# EAGLE design Adafruit Feather 32u4 Basic rev B (EAGLE 6.6.0)
COMPANY: ADAFRUIT INDUSTRIES; DRAWN: KTOWN; REV: B
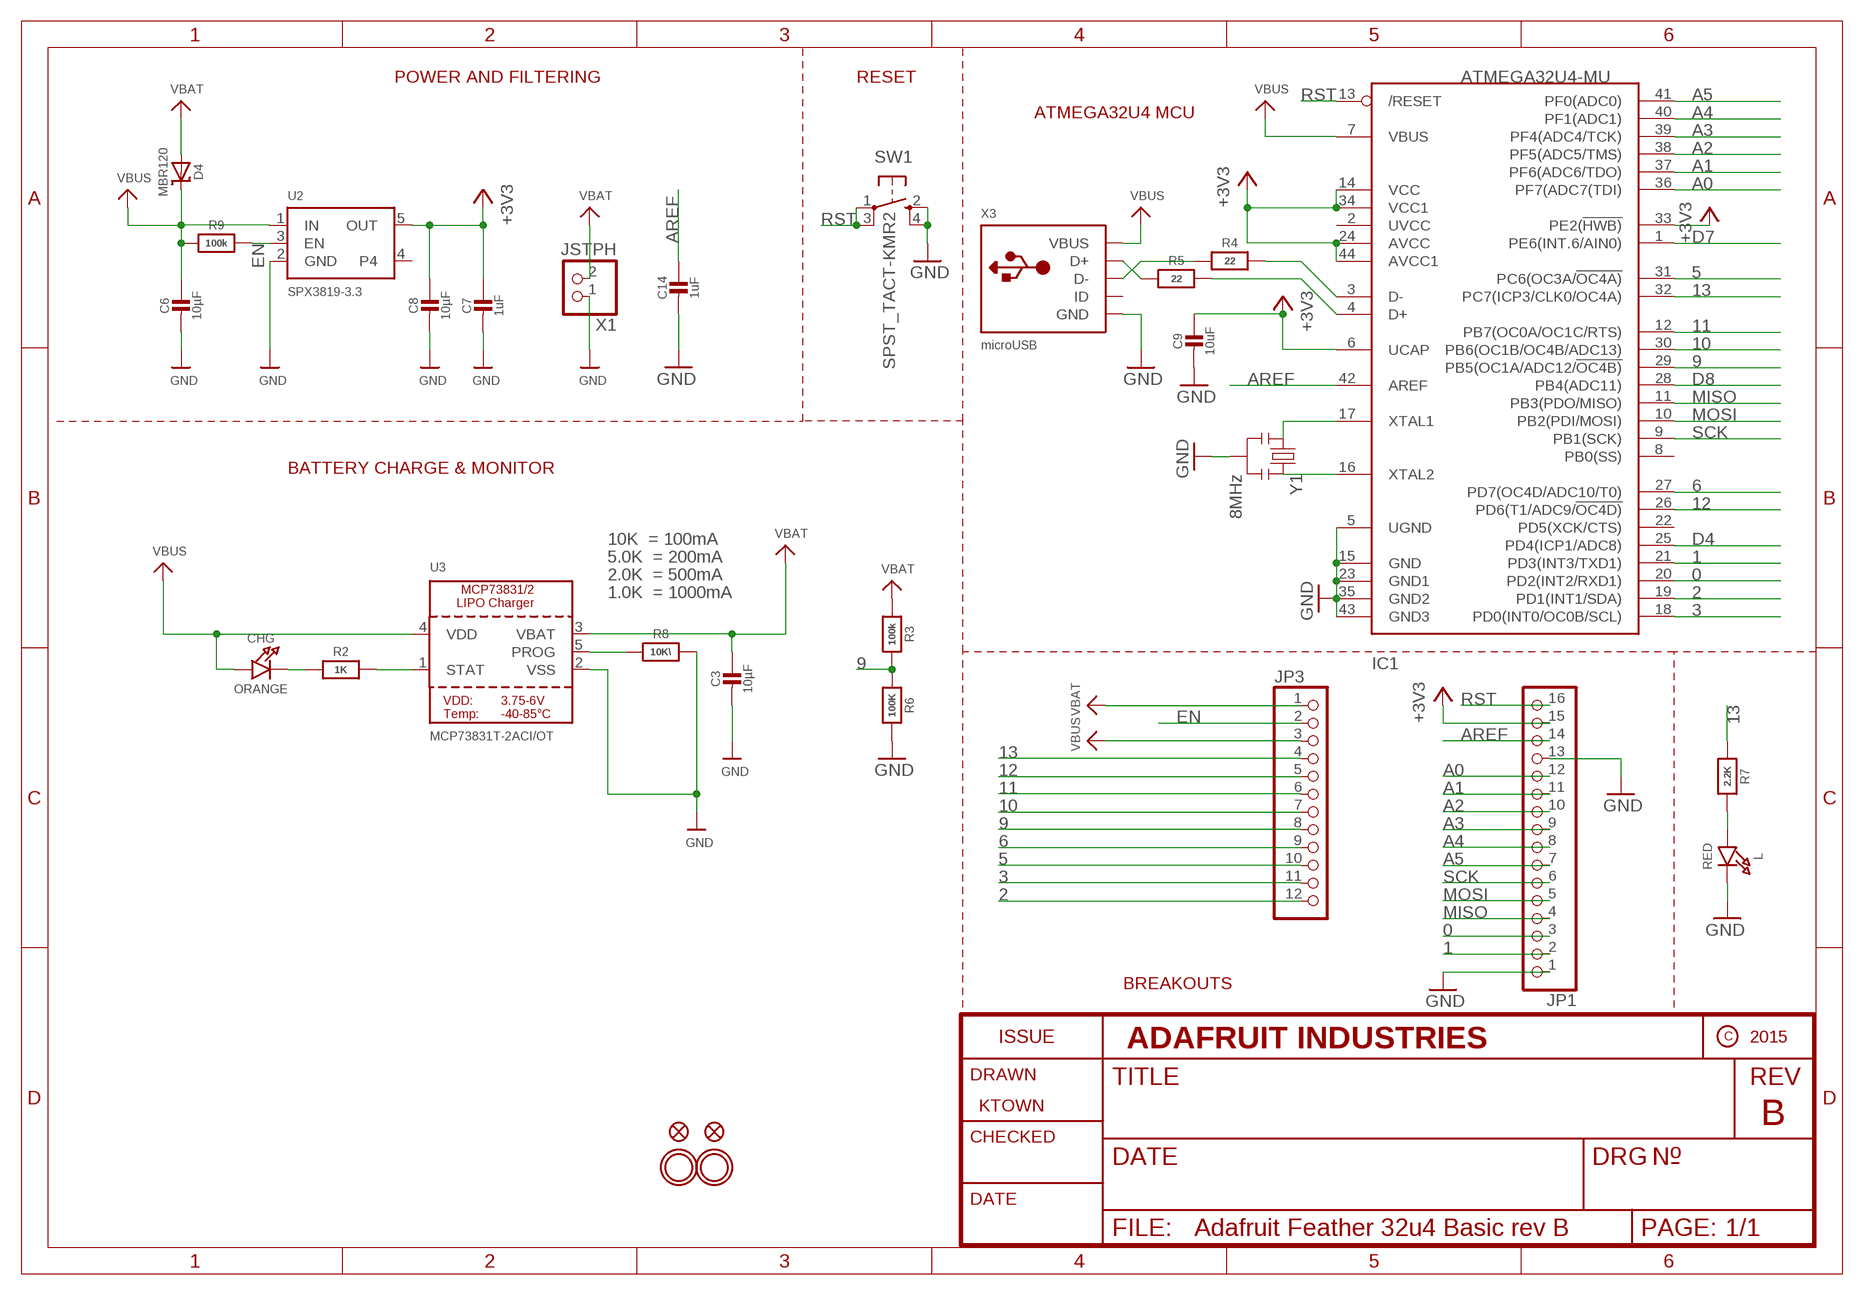
[diagram p0: schematic, sheet 1]

## Parts
C3  10µF  CAP_CERAMIC0805-NOOUTLINE  [0805-NO]
C6  10µF  CAP_CERAMIC0805-NOOUTLINE  [0805-NO]
C7  1uF  CAP_CERAMIC0603_NO  [0603-NO]
C8  10µF  CAP_CERAMIC0805-NOOUTLINE  [0805-NO]
C9  10uF  CAP_CERAMIC0805-NOOUTLINE  [0805-NO]
C14  1uF  CAP_CERAMIC0603_NO  [0603-NO]
CHG  ORANGE  LED0805_NOOUTLINE  [CHIPLED_0805_NOOUTLINE]
D4  MBR120  DIODE-SCHOTTKYSOD-123  [SOD-123]
IC1  ATMEGA32U4-MU  [TQFN44_7MM]
JP1  HEADER-1X16ROUND  [1X16_ROUND]
JP3  HEADER-1X12  [1X12_ROUND]
L  RED  LED0805_NOOUTLINE  [CHIPLED_0805_NOOUTLINE]
R2  1K  RESISTOR_0603_NOOUT  [0603-NO]
R3  100k  RESISTOR_0603_NOOUT  [0603-NO]
R4  22  RESISTOR_0603_NOOUT  [0603-NO]
R5  22  RESISTOR_0603_NOOUT  [0603-NO]
R6  100K  RESISTOR_0603MP  [_0603MP]
R7  2.2K  RESISTOR_0603_NOOUT  [0603-NO]
R8  10K\  RESISTOR_0603_NOOUT  [0603-NO]
R9  100k  RESISTOR_0603_NOOUT  [0603-NO]
SW1  SPST_TACT-KMR2  [KMR2]
U2  SPX3819-3.3  VREG_SOT23-5  [SOT23-5]
U3  MCP73831T-2ACI/OT  MCP73831/2  [SOT23-5]
U$31  MOUNTINGHOLE2.5  [MOUNTINGHOLE_2.5_PLATED]
U$32  MOUNTINGHOLE2.5  [MOUNTINGHOLE_2.5_PLATED]
U$34  FIDUCIAL""  [FIDUCIAL_1MM]
U$35  FIDUCIAL""  [FIDUCIAL_1MM]
X1  JSTPH  CON_JST_PH_2PIN  [JSTPH2]
X3  microUSB  USB_MICRO_20329_V2  [4UCONN_20329_V2]
Y1  8MHz  RESONATORSMD  [RESONATOR-SMD]

## Nets
0: IC1.20(PD2(INT2/RXD1)) JP1.3
1: IC1.21(PD3(INT3/TXD1)) JP1.2
2: IC1.19(PD1(INT1/SDA)) JP3.12
3: IC1.18(PD0(INT0/OC0B/SCL)) JP3.11
5: IC1.31(PC6(OC3A/!OC4A)) JP3.10
6: IC1.27(PD7(OC4D/ADC10/T0)) JP3.9
9: IC1.29(PB5(OC1A/ADC12/!OC4B)) JP3.8 R3.2 R6.1
10: IC1.30(PB6(OC1B/OC4B/ADC13)) JP3.7
11: IC1.12(PB7(OC0A/OC1C/RTS)) JP3.6
12: IC1.26(PD6(T1/ADC9/!OC4D)) JP3.5
13: IC1.32(PC7(ICP3/CLK0/OC4A)) JP3.4 R7.1
+3V3: C7.1 C8.1 C9.1 IC1.6(UCAP) IC1.14(VCC) IC1.24(AVCC) IC1.33(PE2(!HWB)) IC1.34(VCC1) IC1.44(AVCC1) JP1.15 U2.5(OUT)
A0: IC1.36(PF7(ADC7(TDI)) JP1.12
A1: IC1.37(PF6(ADC6/TDO)) JP1.11
A2: IC1.38(PF5(ADC5/TMS)) JP1.10
A3: IC1.39(PF4(ADC4/TCK)) JP1.9
A4: IC1.40(PF1(ADC1)) JP1.8
A5: IC1.41(PF0(ADC0)) JP1.7
AREF: C14.1 IC1.42(AREF) JP1.14
D4: IC1.25(PD4(ICP1/ADC8))
D7: IC1.1(PE6(INT.6/AIN0))
D8: IC1.28(PB4(ADC11))
D+: IC1.4(D+) R5.2
D-: IC1.3(D-) R4.2
EN: JP3.2 R9.2 U2.3(EN)
GND: C3.2 C6.2 C7.2 C8.2 C9.2 C14.2 IC1.5(UGND) IC1.15(GND) IC1.23(GND1) IC1.35(GND2) IC1.43(GND3) JP1.1 JP1.13 L.C R6.2 R8.2 SW1.2(S) SW1.4(S1) U2.2(GND) U3.2(VSS) X1.1 X3.BASE@1(GND) X3.BASE@2(GND) X3.GND X3.SPRT@1(GND) X3.SPRT@2(GND) X3.SPRT@3(GND) X3.SPRT@4(GND) Y1.2
MISO: IC1.11(PB3(PDO/MISO)) JP1.4
MOSI: IC1.10(PB2(PDI/MOSI)) JP1.5
N$1: CHG.C R2.1
N$2: L.A R7.2
N$3: R2.2 U3.1(STAT)
N$4: R8.1 U3.5(PROG)
N$11: IC1.16(XTAL2) Y1.3
N$12: IC1.17(XTAL1) Y1.1
N$15: R5.1 X3.D+
N$16: R4.1 X3.D-
RST: IC1.13(/RESET) JP1.16 SW1.1(P) SW1.3(P1)
SCK: IC1.9(PB1(SCK)) JP1.6
VBAT: C3.1 D4.A JP3.1 R3.1 U3.3(VBAT) X1.2
VBUS: C6.1 CHG.A D4.C IC1.7(VBUS) JP3.3 R9.1 U2.1(IN) U3.4(VDD) X3.VBUS
Unconnected: IC1.2(UVCC) IC1.8(PB0(SS)) IC1.22(PD5(XCK/CTS)) U2.4 X3.ID

## Notes on the sheet
- POWER AND FILTERING | RESET
- ATMEGA32U4 MCU
- BATTERY CHARGE & MONITOR
- 10K  = 100mA
- 5.0K  = 200mA
- 2.0K  = 500mA
- 1.0K  = 1000mA
- BREAKOUTS

## Library data of the parts
C3 C6-C9 C14 = microbuilder:CAP_CERAMIC: Ceramic Capacitors For new designs, use the packages preceded by an '_' character since they are more reliable: The following footprints should be used on most boards: _0402 - Standard footprint for regular board layouts _0603 - Standard footprint for regular board layouts _0805 - Standard footprint for regular board layouts _1206 - Standard footprint for regular board layouts For extremely tight-pitch boards where space is at a premium, the following 'micro-pitch' footprints can be used (smaller pads, no silkscreen outline, etc.): _0402MP - Micro-pitch footprint for very dense/compact boards _0603MP - Micro-pitch footprint for very dense/compact boards _0805MP - Micro-pitch footprint for very dense/compact boards _1206MP - Micro-pitch footprint for very dense/compact boards
CHG L = microbuilder:LED: LED 0603 - 0603 Surface Mount Package 2mA: Green LED - Low Power (3.9mcd, 2ma, 1.7Vf) - Digikey: 475-2709-2-ND Orange LED - Low Power (9.8mcd, 2ma, 1.8Vf) - Digikey: 475-1194-2-ND Red LED - Low Power (5mcd, 2ma, 1.8Vf) - Digikey: 475-1195-2-ND Yellow LED - Low Power (7mcd, 2ma, 1.8Vf) - Digikey: 475-1196-2-ND 5mA: Blue LED - Low Power (17mcd, 5ma, 2.9Vf) - Digikey: LNJ937W8CRACT-ND 0805 - 0805 Surface Mount Package 2mA: Red LED (8.8mcd, 2mA, 1.8Vf, Clear) - Low Power [Digikey: 475-2510-1-ND] Green LED (5mcd, 2mA, 1.8Vf, Clear) - Low Power [Digikey: 475-2730-1-ND] Yellow LED (11.3mcd, 2mA, 1.8Vf, Clear) - Low Power [Digikey: 475-2555-1-ND] 20mA: Red LED (104mcd, 20mA, Diffused) - LS R976 [Digikey: 475-1278-6-ND] Red LED (12mcd, 20mA, 2.0Vf, Clear) - APT2012EC [Digikey: 754-1128-1-ND] Green LED (15mcd, 20mA, 2.2Vf, Clear) - APT2012GC [Digikey: 754-1131-1-ND] Orange LED (160mcd, 20mA, 2.1Vf, Clear) - APT2012SECK [Digikey: 754-1130-1-ND] 1206 - 1206 Surface Mount Package Green LED (26mcd, 20mA, Diffused) - LG N971 [Digikey: 475-1407-6-ND] Red LED (15mcd, 20mA, Diffused) - LH N974 [Digikey: 475-1416-6-ND] Cree - Cree High-Power Surface Mount LEDs XPEBWT-L1-0000-00D50 - White 111lm 350mA 2.9Vf 6200K 110° XTEAWT-00-0000-00000LEE3 - White 114lm 350mA 2.85Vf 5000K 115° Everlight - Everlight 45-21 Series Surface Mount LEDs 45-21/QK2C-B2832AC2CB2/2T - Warm White 2000mcd 20mA 3.25Vf 3050K 120° 45-21/LK2C-B38452C4CB2/2T - Nuetral White 2000mcd 20mA 3.25Vf 4150K 120° 45-21/LK2C-B50634C6CB2/2T - Cold White 2200mcd 20mA 3.25Vf 5650K 120° PLCC2 Reverse Mount LS T77K-J1L2-1-0-2-R18-Z - Red 11.25mcd 2mA 1.8Vf 630nm 120° LO T77K-L1M2-24-Z - Orange 19.6mcd 2mA 1.8Vf 606nm 120° LY T77K-K2M1-26-Z - Yellow 15.7mcd 2mA 1.8Vf 587nm 120°
D4 = microbuilder:DIODE-SCHOTTKY
IC1 = microbuilder:ATMEGA32U4: http://www.ladyada.net/library/eagle
JP1 = microbuilder:HEADER-1X16: PIN HEADER
JP3 = microbuilder:HEADER-1X12
R2-R9 = microbuilder:RESISTOR: Resistors For new designs, use the packages preceded by an '_' character since they are more reliable: The following footprints should be used on most boards: _0402 - Standard footprint for regular board layouts _0603 - Standard footprint for regular board layouts _0805 - Standard footprint for regular board layouts _1206 - Standard footprint for regular board layouts For extremely tight-pitch boards where space is at a premium, the following 'micro-pitch' footprints can be used (smaller pads, no silkscreen outline, etc.): _0402MP - Micro-pitch footprint for very dense/compact boards _0603MP - Micro-pitch footprint for very dense/compact boards _0805MP - Micro-pitch footprint for very dense/compact boards _1206MP - Micro-pitch footprint for very dense/compact boards
SW1 = adafruit:SPST_TACT: SMT 6mm switch, EVQQ2 series http://www.ladyada.net/library/eagle
U2 = microbuilder:VREG_SOT23-5: SOT23-5 Fixed Voltage Regulators Part Current Out V Out V In V Dropout θJA (°C/W) TJ (°C) Digikey Part No. ADP121 150mA 3.3V 3.4-5.5V 0.09V @ 150mA -- -- ADP121-AUJZ33R7CT-ND ADP121 150mA 3.0V 3.1-5.5V 0.09V @ 150mA -- -- ADP121-AUJZ30R7CT-ND ADP122 300mA 3.3V 3.4-5.5V 0.085V @ 300mA -- -- ADP122AUJZ-3.3-R7CT-ND ADP1712 300mA 3.3V 3.5-5.5V 0.17V @ 300mA -- -- ADP1712AUJZ-3.3-R7TR-ND AP7311 (Low Cost) 150mA 3.3V 3.5-6V 0.15V @ 150mA -- -- AP7311-33WG-7DICT-ND LD39015M18R 150mA 1.8V 1.9V-5.5V 0.08V @ 100mA -- -- 497-6977-1-ND LP2985A-33DBVR 150mA 3.3V 3.3-16V 0.28V @ 150mA 206 150 296-18479-1-ND MCP1824T-3302E/OT 300mA 3.3V 3.5V-6V 0.2V @ 300mA -- -- MCP1824T-3302E/OTCT-ND MIC5205-2.5YM5 TR 150mA 2.5V 2.7-16V 0.165V @ 150mA -- -- 576-1257-2-ND MIC5205-3.0YM5 TR 150mA 3.0V 3.2V-16V 0.165V @ 150mA -- -- 576-1258-2-ND MIC5205-3.3YM5 TR 150mA 3.3V 3.5V-16V 0.165V @ 150mA -- -- 576-1259-2-ND TPS780330220 150mA 3.3V+2.2V 3.6-5.5V 250mV Max -- -- 296-23332-1-ND TDA3663/N1,135 100mA 3.3V 3.5-45V 0.18V @ 50mA -- -- 568-5343-1-ND Max operating temp can be calculated using θJA, TJ (max junction temperature), and power in watts. Set the "Maximum Ambient Temperature" until it reaches TJ ("Max Junction Temperature"), which is the absolute limit for safe use of the regulator: Heat Sink Temperature Calculator <http://www.daycounter.com/Calculators/Heat-Sink-Temperature-Calculator.phtml> For example, With 12V source into a 3.3V LP2985 and a 30mA load, we are dissipating (12V-3.3V) * 0.03A = 0.261W. With a θJA of 206 °C/W, a TJ of 150°C, and 261mW we can safely use the chip without a heat sink up to 75°C (=147.1°C Junction Temperature).
U3 = microbuilder:MCP73831/2: MCP73831/2 LIPO Charger VDD: 3.75 - 6V Temp -40 - 85°C Programmable Charge Rate: 15-500mA NOTE: STAT is a tri-state logic output on the MCP73831 and an open-drain output on the MCP73832. SOT23-5 with 4.2V output and tri-state logic on STAT = MCP73831T-2ACI/OT
U$31 U$32 = microbuilder:MOUNTINGHOLE: Mounting Hole For #2 screws (0.086"/2.18mm width, 0.094"/2.4mm hole) use 2.5mm; BOM: EXCLUDE
U$34 U$35 = microbuilder:FIDUCIAL: Fiducial Alignment Points Various fiducial points for machine vision alignment.; BOM: EXCLUDE
X1 = microbuilder:CON_JST_PH_2PIN: JST 2-Pin Right-Angle Connector PH-Series - 4UConnector: 17311 SH-Series - 4UConnector: 07278
X3 = microbuilder:USB: USB Connectors USBMINIB - Surface Mount Female Mini-B USB Connector 4UConnector: 06564
Y1 = SparkFun:RESONATOR: Resonator Small SMD resonator. This is the itty bitty 10/20MHz resonators with built in caps. CSTCE10M0G55 and CSTCE20M0V53. Footprint has been reviewed closely but hasn't been tested yet.

## Board
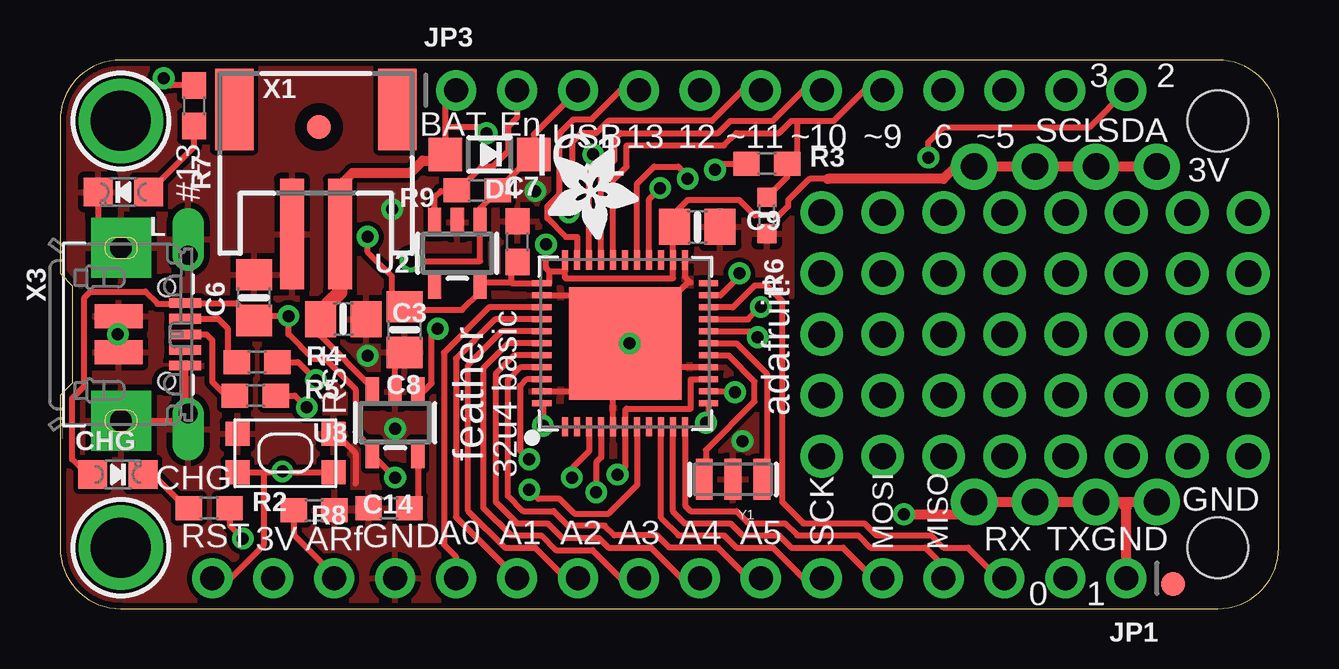
[diagram p1: board, top side]
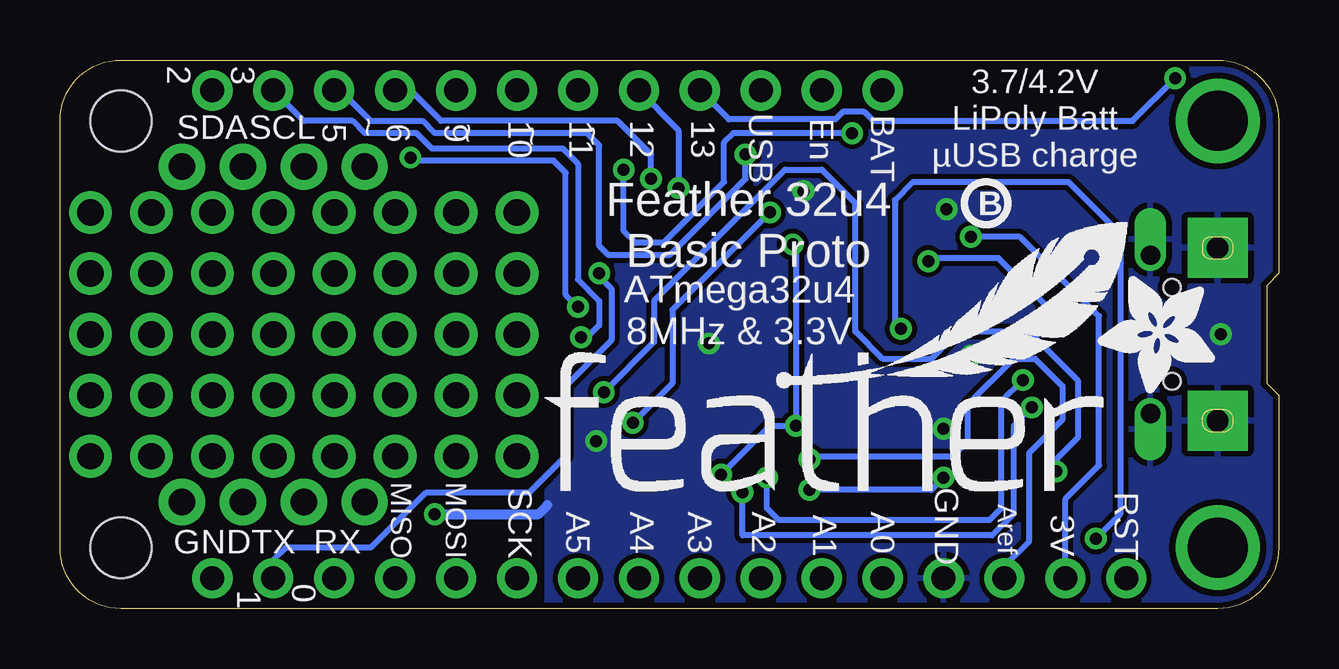
[diagram p2: board, bottom side, seen from below]

Size 50.8 x 22.86 mm. Coordinates in mm from the lower left corner, seen from the top.
Outline: 2.54,0 48.26,0 arc90 50.8,2.54 50.8,20.32 arc90 48.26,22.86 2.54,22.86 arc90 0,20.32 0,13.97 0.51,13.46 0.51,9.4 0,8.89 0,2.54 arc90 2.54,0
Copper layers (1*16): Top 0.035mm / dielectric 1.5mm / Bottom 0.035mm
Design rules "adafruit *": minimum track width 8mil, minimum drill 15.5mil, track to track 8mil, track to pad 8mil, pad to pad 8mil, via to via 8mil, smd to smd 8mil, copper to edge 10mil, drill to drill 8mil, minimum pad ring 10mil, minimum via ring 8mil, stop-mask expansion 2mil, vias tented up to drill 20mil, thermal gap 10mil
Holes 2.54 mm at 48.26,20.32 48.26,2.54
tRestrict: area 20.8,9.3 to 21.1,12.8; area 20.7,8.1 to 22.9,8.5; area 26.2,10.3 to 26.5,13.3

### Footprints (pad centres in the part's own frame; a part is rotated, then mirrored left to right if it is on the bottom)
0805-NO = smd 1.3 x 1.5: 1 -0.95,0; 2 0.95,0
0603-NO = smd 1.1 x 1: 1 -0.85,0; 2 0.85,0
CHIPLED_0805_NOOUTLINE = smd 1.2 x 1.2: A 0,-1.05; C 0,1.05
SOD-123 = smd 1.4 x 1.4: A 1.85,0; C -1.85,0
TQFN44_7MM = smd 0.25 x 0.8: 1 -2.5,-3.475; 2 -2,-3.475; 3 -1.5,-3.475; 4 -1,-3.475; 5 -0.5,-3.475; 6 0,-3.475; 7 0.5,-3.475; 8 1,-3.475; 9 1.5,-3.475; 10 2,-3.475; 11 2.5,-3.475; 23 2.5,3.475; 24 2,3.475; 25 1.5,3.475; 26 1,3.475; 27 0.5,3.475; 28 0,3.475; 29 -0.5,3.475; 30 -1,3.475; 31 -1.5,3.475; 32 -2,3.475; 33 -2.5,3.475 | smd 0.8 x 0.25: 12 3.475,-2.5; 13 3.475,-2; 14 3.475,-1.5; 15 3.475,-1; 16 3.475,-0.5; 17 3.475,0; 18 3.475,0.5; 19 3.475,1; 20 3.475,1.5; 21 3.475,2; 22 3.475,2.5; 34 -3.475,2.5; 35 -3.475,2; 36 -3.475,1.5; 37 -3.475,1; 38 -3.475,0.5; 39 -3.475,0; 40 -3.475,-0.5; 41 -3.475,-1; 42 -3.475,-1.5; 43 -3.475,-2; 44 -3.475,-2.5 | smd 4.7 x 4.7: THERMAL 0,0
1X16_ROUND = drill 1 pad 1.676: 1 -19.05,0; 2 -16.51,0; 3 -13.97,0; 4 -11.43,0; 5 -8.89,0; 6 -6.35,0; 7 -3.81,0; 8 -1.27,0; 9 1.27,0; 10 3.81,0; 11 6.35,0; 12 8.89,0; 13 11.43,0; 14 13.97,0; 15 16.51,0; 16 19.05,0
1X12_ROUND = drill 1 pad 1.676: 1 -13.97,0; 2 -11.43,0; 3 -8.89,0; 4 -6.35,0; 5 -3.81,0; 6 -1.27,0; 7 1.27,0; 8 3.81,0; 9 6.35,0; 10 8.89,0; 11 11.43,0; 12 13.97,0
_0603MP = smd 0.8 x 0.8: 1 -0.762,0; 2 0.762,0
KMR2 = smd 1 x 1: 1 2,0.8; 2 2,-0.8; 3 -2,0.8; 4 -2,-0.8
SOT23-5 = smd 0.55 x 1.2: 1 -0.95,-1.3; 2 0,-1.3; 3 0.95,-1.3; 4 0.95,1.3; 5 -0.95,1.3
MOUNTINGHOLE_2.5_PLATED = drill 2.5 pad 3.2: P$1 0,0
FIDUCIAL_1MM = smd 1 x 1: 1 0,0
JSTPH2 = smd 1 x 4.6: 1 -1,-3.7; 2 1,-3.7 | smd 1.6 x 3.4: NC1 -3.4,1.5; NC2 3.4,1.5
4UCONN_20329_V2 = smd 1 x 2: BASE@1 -0.75,-2; BASE@2 0.75,-2 | smd 0.4 x 1.35: D+ 0,0.775; D- -0.65,0.775; GND 1.3,0.775; ID 0.65,0.775; VBUS -1.3,0.775 | drill 0.8 pad 1.2 offset: SPRT@1 -3.3,0.9; SPRT@2 3.3,0.9 | drill 0.9 pad 2.5 square: SPRT@3 -3.6,-1.9; SPRT@4 3.6,-1.9 | hole 0.7: -1.95,0; 1.95,0
RESONATOR-SMD = smd 0.7 x 1.7: 1 -1.2,0; 2 0,0; 3 1.2,0

### Placement (x,y rotation side)
C3  11.81,12.06 0 top
C6  8.09,12.96 90 top
C7  19.07,15.29 90 top
C8  14.37,11.62 270 top
C9  26.57,15.91 0 top
C14  10.59,4.09 0 top
CHG  2.41,5.59 270 top
D4  17.91,18.92 180 top
IC1  23.56,11.05 0 top
JP1  25.4,1.27 180 top
JP3  30.48,21.59 0 top
L  2.65,17.36 90 top
R2  6.22,4.19 0 top
R3  29.46,18.54 0 top
R4  8.22,10.27 0 top
R5  8.15,8.88 0 top
R6  29.46,16.38 270 top
R7  5.59,20.95 270 top
R8  13.72,4.19 180 top
R9  17.4,17.42 180 top
SW1  9.4,6.48 180 top
U2  16.56,14.81 180 top
U3  13.97,7.75 180 top
U$4  [ADAFRUIT_5MM]  2.67,13.84 180 bottom
U$5  [FEATHERLOGO]  30.61,4.83 0 bottom
U$6  [PCBFEAT-REV-040]  12.19,16.89 0 bottom
U$7  [ADAFRUIT_3.5MM]  20.32,19.18 270 top
U$31  2.54,20.32 270 top
U$32  2.54,2.54 270 top
U$34  10.79,20.07 270 top
U$35  46.4,1.02 270 top
X1  10.67,19.3 0 top
X3  4.45,11.43 270 top
Y1  28.06,5.39 180 top

### Tracks (layer width: path | path; a pad name or v marks a point on that pad's centre or on a via)
0
  Top 0.254: JP1.3 39.12,1.27 37.85,2.54 36.83,2.54 36.32,3.05 34.04,3.05 33.53,3.56 30.99,3.56 30.1,4.45 30.1,12.83 29.46,13.46 28.96,13.46 28.04,12.55 IC1.20
1  (via drill 0.5)
  Top 0.254: v28.32,13.97 28.45,13.97 27.53,13.05 IC1.21
  Bottom 0.254: v28.32,13.97 28.45,13.97 27.81,13.34 27.81,11.18 29.72,9.27 29.72,6.35 31.24,4.83 35.56,4.83 37.85,2.54 41.4,2.54 41.91,2.03 JP1.2
2  (via drill 0.5)
  Top 0.254: IC1.19 28.69,12.05 v29.21,12.57 | v36.2,18.8 36.2,19.43 36.83,20.07 42.93,20.07 JP3.12
  Bottom 0.254: v29.21,12.57 29.72,13.08 29.72,18.16 30.23,18.67 36.07,18.67 v36.2,18.8
3  (via drill 0.5)
  Top 0.254: IC1.18 28.84,11.55 v29.08,11.3
  Bottom 0.254: JP3.11 40.64,20.32 38.61,20.32 38.1,19.81 35.94,19.81 35.31,19.18 29.84,19.18 29.21,18.54 29.21,13.72 28.32,12.83 28.32,11.8 28.82,11.3 v29.08,11.3
5  (via drill 0.5)
  Top 0.254: IC1.31 22.06,18.76 v22.23,18.92
  Bottom 0.254: 39.5,21.59 JP3.10 39.12,21.59 37.85,20.32 35.69,20.32 35.18,19.81 28.83,19.81 28.32,19.3 28.32,15.11 27.94,14.73 25.4,14.73 22.23,17.91 v22.23,18.92
6  (via drill 0.5)
  Top 0.254: IC1.27 24.06,17.71 24.77,18.41 25.78,18.41 26.16,18.03 v26.16,17.91
  Bottom 0.254: JP3.9 36.2,21.59 34.92,20.32 27.56,20.32 26.16,18.92 v26.16,17.91
9
  Top 0.254: JP3.8 33.53,21.59 32.26,20.32 30.73,20.32 | IC1.29 23.06,17.85 23.62,18.41 23.62,19.3 27.69,19.3 28.19,19.81 29.97,19.81 30.48,20.32 30.73,20.32 | 30.73,20.32 30.73,18.96 R3.2 30.31,18 R6.1
10
  Top 0.254: JP3.7 30.99,21.59 29.72,20.32 27.94,20.32 27.43,19.81 23.37,19.81 23.11,19.56 23.11,18.67 22.56,18.11 IC1.30
11  (via drill 0.5)
  Top 0.254: JP3.6 28.45,21.59 27.18,20.32 22.86,20.32 22.35,19.81 21.72,19.81 21.34,19.43 21.34,16.51 v21.21,16.51 | IC1.12 27.03,7.86 v26.92,7.75
  Bottom 0.254: v21.21,16.51 25.27,12.45 25.27,9.4 v26.92,7.75
12  (via drill 0.5)
  Top 0.254: IC1.26 24.56,17.07 v25.02,17.53
  Bottom 0.254: JP3.5 25.02,19.94 v25.02,17.53
13  (via drill 0.5)
  Top 0.254: R7.1 4.61,21.8 v4.32,22.1 | IC1.32 21.56,15.49 21.08,15.49 20.32,16.26 20.32,16.76 20.83,17.27 20.83,19.81 21.4,20.38 22.16,20.38 23.37,21.59 JP3.4
  Bottom 0.254: JP3.4 22.92,20.38 18.48,20.38 18.16,20.7 17.27,20.7 16.89,20.32 6.1,20.32 v4.32,22.1
+3V3  (via drill 0.5, 1.1 pad 1.93)
  Top 0.254: 20.39,14.07 20.26,14.2 v20.26,15.18 | 18.8,13.6 17.6,13.6 U2.5 17.46,13.46 17.46,13.14 16.76,12.45 14.49,12.45 C8.1 13.84,13.1 13.84,13.84 12.83,14.86 v12.83,15.49 | C7.1 18.8,14.17 18.8,13.6 | v23.24,5.59 23.56,5.91 IC1.6 23.56,8.27 23.62,8.33 26.3,8.33 26.3,9.55 IC1.14 | 32,17.91 31.24,17.91 30.35,17.02 30.35,16.76 29.97,16.38 28.96,16.38 28.32,17.02 26.16,17.02 25.61,16.47 C9.1 25.59,15.9 25.56,15.88 IC1.24 25.56,13.77 21.06,13.77 IC1.33 21.06,14.07 20.39,14.07 | 18.8,13.6 18.85,13.55 IC1.34 20.39,13.55 20.39,14.07 | IC1.44 20.13,8.5 v20.13,7.62
  Top 0.406: v45.72,18.41 v43.18,18.41 v40.64,18.41 v38.1,18.41 37.34,18.41 36.83,17.91 32,17.91
  Bottom 0.254: JP1.15 8.89,4.57 7.49,5.97 7.49,12.19 10.79,15.49 v12.83,15.49 | v20.26,15.18 20.13,15.05 v20.13,7.62 21.21,7.62 v23.24,5.59
A0
  Top 0.254: JP1.12 16.51,2.16 16,2.67 16,10.67 17.88,12.55 IC1.36
A1
  Top 0.254: JP1.11 16.51,3.81 16.51,10.41 18.14,12.05 IC1.37
A2
  Top 0.254: JP1.10 21.08,1.27 19.81,2.54 18.54,2.54 17.02,4.06 17.02,10.16 18.41,11.55 IC1.38
A3
  Top 0.254: JP1.9 23.37,1.27 22.2,2.44 20.68,2.44 20.07,3.05 18.8,3.05 17.65,4.19 17.65,10.03 18.67,11.05 IC1.39
A4
  Top 0.254: JP1.8 25.91,1.27 24.64,2.54 22.86,2.54 22.45,2.95 20.93,2.95 20.32,3.56 19.05,3.56 18.16,4.45 18.16,9.78 18.93,10.55 IC1.40
A5
  Top 0.254: JP1.7 28.7,1.27 27.43,2.54 25.4,2.54 24.89,3.05 23.11,3.05 22.71,3.45 21.18,3.45 20.57,4.06 19.3,4.06 18.67,4.7 18.67,9.53 19.19,10.05 IC1.41
AREF  (via drill 0.5)
  Top 0.254: 19.3,6.48 v19.56,6.22 19.18,6.6 19.18,9.27 19.45,9.55 IC1.42 | C14.1 9.74,3.08 11.43,1.4 JP1.14
  Bottom 0.254: v19.56,6.22 19.43,6.35 13.59,6.35 12.95,6.99 12.95,8.51 11.05,10.41 10.16,10.41 9.02,9.27 9.02,7.87 10.41,6.48 10.41,2.79 11.43,1.78 JP1.14
D+  (via drill 0.5)
  Top 0.254: R5.2 9.79,8.88 v10.29,8.38 | 22.35,5.08 v22.35,4.85 22.35,6.1 22.56,6.3 IC1.4
  Bottom 0.254: v22.35,4.85 22.35,3.05 11.94,3.05 11.05,3.94 11.05,7.62 v10.29,8.38
D-  (via drill 0.5)
  Top 0.254: R4.2 9.93,10.27 v10.67,9.53 | IC1.3 22.06,6.56 21.34,5.84 v21.34,5.46
  Bottom 0.254: v21.34,5.46 21.34,4.19 20.83,3.68 12.06,3.68 11.56,4.19 11.56,8.64 v10.67,9.53
EN
  Top 0.254: JP3.2 19.05,20.45 18.67,20.07 18.67,19.05 18.03,18.41 17.57,18.41 16.57,17.42 R9.2 16.52,17.4 15.88,17.4 15.61,17.14 U2.3
GND  (via drill 0.5, 1.1 pad 1.93)
  Top 0.254: 22.08,13.1 22.13,13.05 | 22.13,13.05 23.88,11.3 | 26.22,13.64 23.88,11.3 | L.C 1.59,15.03 X3.SPRT@3 | X3.GND 5.22,8.26 X3.SPRT@2 5.04,7.83 X3.SPRT@4 | 23.88,11.3 23.88,11.18 v23.75,11.05 | U3.2 13.97,10.67 C8.2 | SW1.4 11.52,7.28 12.32,6.48 12.32,5.21 | v23.75,11.05 23.75,10.54 22.26,9.05 IC1.43 | 23.22,10.52 v23.75,11.05 | IC1.23 26.06,13.82 26.29,13.59 | IC1.15 24.75,10.05 v23.75,11.05 | IC1.5 23.06,10.36 v23.75,11.05 | IC1.35 22.13,13.05
  Top 0.406: v35.18,3.94 37.59,3.94 v38.1,4.45 v40.64,4.45 v43.18,4.45 44.2,4.45 | 44.2,4.45 v45.72,4.45 | JP1.1 44.45,4.19 44.2,4.45
  Bottom 0.406: v35.18,3.94 30.86,3.94 30.48,4.32
  other vias: 28.45,6.99 2.41,11.43 19.81,17.4 12.83,10.54 13.97,7.49 13.84,16.64
  pour Top: 0,22.86 0,0 30.48,0 30.48,22.86
  pour Bottom: 0,0 30.48,0 30.48,22.86 0,22.86
MISO
  Top 0.254: JP1.4 36.83,1.78 36.07,2.54 33.78,2.54 33.27,3.05 30.73,3.05 30.23,3.56 28.7,3.56 28.19,4.06 26.29,4.06 26.06,4.29 IC1.11
MOSI
  Top 0.254: JP1.5 33.91,1.27 32.64,2.54 30.48,2.54 29.97,3.05 28.45,3.05 27.94,3.56 26.04,3.56 25.56,4.03 IC1.10
N$1
  Top 0.254: CHG.C 3.88,5.59 5.27,4.19 R2.1
N$2
  Top 0.254: L.A 5.59,19.25 R7.2
N$3  (via drill 0.5)
  Top 0.254: U3.1 15.14,9.05 15.49,9.4 15.49,11.4 v15.75,11.66 | R2.2 7.07,3.47 v7.62,2.92
  Bottom 0.254: v15.75,11.66 16,11.91 16,17.02 15.24,17.78 8.76,17.78 6.6,15.62 6.6,3.94 v7.62,2.92
N$4
  Top 0.254: U3.5 14.92,4.54 R8.1
N$5  (via drill 1.1 pad 1.78)
  other vias: 49.53,16.51
N$6  (via drill 1.1 pad 1.78)
  other vias: 49.53,13.97
N$7  (via drill 1.1 pad 1.78)
  other vias: 49.53,11.43
N$8  (via drill 1.1 pad 1.78)
  other vias: 49.53,8.89
N$9  (via drill 1.1 pad 1.78)
  other vias: 49.53,6.35
N$10  (via drill 1.1 pad 1.78)
  other vias: 46.99,6.35
N$11
  Top 0.254: IC1.16 27.87,10.55 28.96,9.46 28.96,8.64 26.92,6.6 26.92,5.46 Y1.3
N$12
  Top 0.254: IC1.17 28.19,11.05 29.46,9.78 29.46,5.59 Y1.1
N$13  (via drill 1.1 pad 1.78)
  other vias: 44.45,6.35
N$14  (via drill 1.1 pad 1.78)
  other vias: 41.91,6.35
N$15
  Top 0.254: X3.D+ 6.1,11.43 6.35,11.18 6.35,9.45 6.92,8.88 R5.1
N$16
  Top 0.254: X3.D- 6.59,12.08 6.99,11.68 6.99,10.65 R4.1
N$17  (via drill 1.1 pad 1.78)
  other vias: 39.37,6.35
N$18  (via drill 1.1 pad 1.78)
  other vias: 36.83,6.35
N$19  (via drill 1.1 pad 1.78)
  other vias: 34.29,6.35
N$20  (via drill 1.1 pad 1.78)
  other vias: 34.29,8.89
N$21  (via drill 1.1 pad 1.78)
  other vias: 34.29,11.43
N$22  (via drill 1.1 pad 1.78)
  other vias: 34.29,13.97
N$23  (via drill 1.1 pad 1.78)
  other vias: 34.29,16.51
N$24  (via drill 1.1 pad 1.78)
  other vias: 36.83,16.51
N$25  (via drill 1.1 pad 1.78)
  other vias: 39.37,16.51
N$26  (via drill 1.1 pad 1.78)
  other vias: 41.91,16.51
N$27  (via drill 1.1 pad 1.78)
  other vias: 44.45,16.51
N$28  (via drill 1.1 pad 1.78)
  other vias: 46.99,16.51
N$29  (via drill 1.1 pad 1.78)
  other vias: 46.99,13.97
N$30  (via drill 1.1 pad 1.78)
  other vias: 46.99,11.43
N$31  (via drill 1.1 pad 1.78)
  other vias: 44.45,11.43
N$32  (via drill 1.1 pad 1.78)
  other vias: 36.83,11.43
N$33  (via drill 1.1 pad 1.78)
  other vias: 39.37,11.43
N$34  (via drill 1.1 pad 1.78)
  other vias: 41.91,11.43
N$35  (via drill 1.1 pad 1.78)
  other vias: 41.91,8.89
N$36  (via drill 1.1 pad 1.78)
  other vias: 39.37,8.89
N$37  (via drill 1.1 pad 1.78)
  other vias: 36.83,8.89
N$38  (via drill 1.1 pad 1.78)
  other vias: 44.45,8.89
N$39  (via drill 1.1 pad 1.78)
  other vias: 46.99,8.89
N$40  (via drill 1.1 pad 1.78)
  other vias: 44.45,13.97
N$41  (via drill 1.1 pad 1.78)
  other vias: 41.91,13.97
N$42  (via drill 1.1 pad 1.78)
  other vias: 39.37,13.97
N$43  (via drill 1.1 pad 1.78)
  other vias: 36.83,13.97
N$44  (via drill 1.1 pad 1.78)
  other vias: 31.75,16.51
N$45  (via drill 1.1 pad 1.78)
  other vias: 31.75,13.97
N$46  (via drill 1.1 pad 1.78)
  other vias: 31.75,11.43
N$47  (via drill 1.1 pad 1.78)
  other vias: 31.75,8.89
N$48  (via drill 1.1 pad 1.78)
  other vias: 31.75,6.35
RST  (via drill 0.5)
  Top 0.254: SW1.1 8.51,5.68 | 6.48,1.27 JP1.16 7.11,1.27 8.51,2.67 8.51,5.68 | 8.51,5.68 9.27,5.68 | 9.27,5.68 v9.27,5.71 | 9.27,5.68 SW1.3 | IC1.13 28.1,9.05 v28.13,9.02
  Bottom 0.254: v9.27,5.71 9.27,6.22 8.38,7.11 8.38,9.53 10.41,11.56 13.34,11.56 14.48,10.41 16.51,10.41 17.65,11.56 17.65,16.89 19.05,18.29 20.57,18.29 26.04,12.83 26.04,11.11 v28.13,9.02
SCK
  Top 0.254: JP1.6 30.99,1.27 29.72,2.54 28.19,2.54 27.69,3.05 25.78,3.05 25.06,3.77 IC1.9
VBAT  (via drill 0.5)
  Top 0.254: U3.3 13.02,9.21 10.86,11.36 C3.1 11.18,12.38 | JP3.1 16.06,21.14 16.06,20.07 | 16.06,20.07 D4.A | v17.78,19.81 17.53,20.07 16.06,20.07 | v27.3,18.29 27.56,18.54 R3.1
  Top 0.406: X1.2 11.67,17.64 12.19,18.16 14.61,18.16 15.11,18.67 15.8,18.67 D4.A
  Top 0.61: X1.2 11.67,13.19 11.18,12.7 11.18,12.38
  Bottom 0.254: v17.78,19.81 22.73,19.81 23.11,19.43 23.11,17.78 25.65,15.24 26.8,15.24 27.3,15.75 v27.3,18.29
VBUS  (via drill 0.5)
  Top 0.254: JP3.3 19.76,19.76 D4.C 19.75,18.92 R9.1 17.51,16.69 U2.1 17.51,14.48 v14.61,14.48 | CHG.A 1.14,5.59 0.51,6.22 0.51,8.76 1.02,9.27 1.02,12.95 1.27,13.21 3.56,13.21 4.06,12.7 5.19,12.7 X3.VBUS 7.37,12.73 C6.1 8.27,12.19 v9.53,12.19 9.53,11.43 10.54,10.41 11.05,10.41 12.32,9.14 12.32,7.37 13.02,6.67 U3.4 13.02,6.41 v13.97,5.46 | v19.56,4.95 19.94,4.57 20.83,4.57 21.44,3.96 22.87,3.96 24.05,5.14 24.07,5.14 IC1.7
  Bottom 0.254: v14.61,14.48 14.48,14.61 11.68,14.61 9.53,12.45 v9.53,12.19 | v13.97,5.46 14.48,4.95 v19.56,4.95

### Text on the board
tPlace: 3 | 2 | BAT | En | USB | 13 | 12 | ~11 | ~ | 10 | ~9 | 6 | ~5 | SCL | SDA | #13 | 3V | adafruit! | RST | feather | 32u4 basic | CHG | GND | SCK | MOSI | MISO | RST | 3V | ARf | GND | A0 | A1 | A2 | A3 | A4 | A5 | RX | TX | GND | 0 | 1
bPlace: 3 | 2 | 3.7/4.2V / LiPoly Batt / µUSB charge | En | 13 | 12 | ~ | 11 | ~ | 10 | ~ | 9 | 6 | ~ | 5 | SCL | SDA | BAT | USB | Feather 32u4 / Basic Proto | ATmega32u4 / 8MHz & 3.3V | SCK | MOSI | MISO | RST | 3V | Aref | GND | A0 | A1 | A2 | A3 | A4 | A5 | RX | TX | GND | 0 | 1